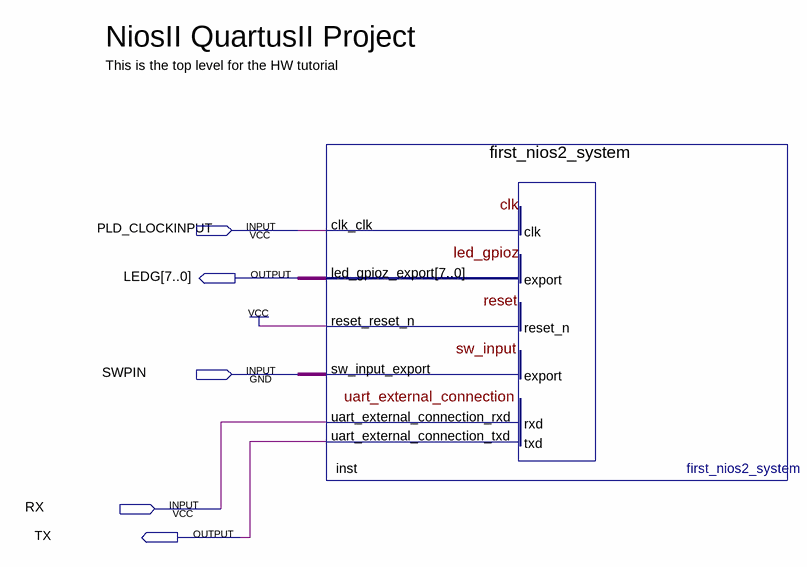
[diagram p0: schematic sheet]
// Quartus schematic nios2_quartus2_project.bdf as structural Verilog: 1 symbols, 5 pins
module nios2_quartus2_project (
  input  PLD_CLOCKINPUT,
  input  SWPIN,
  input  RX,
  output [7:0] LEDG,
  output TX
);

  first_nios2_system inst (
    .clk_clk(PLD_CLOCKINPUT), .reset_reset_n(1'b1), .sw_input_export(SWPIN),
    .uart_external_connection_rxd(RX), .led_gpioz_export(LEDG), .uart_external_connection_txd(TX));

  // Notes on the sheet:
  //   NiosII QuartusII Project
  //   This is the top level for the HW tutorial
endmodule
